# Altium project PAM_Interface_No_Bit_Shift.PrjPcb
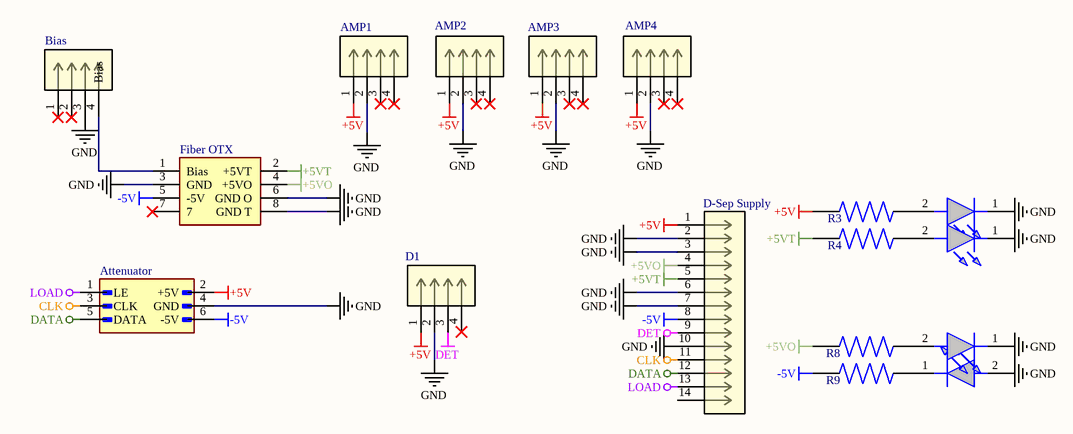
[diagram p0: PAM_Interface_No_Bit_Shift.SchDoc]
1 sheet, 17 parts. Net scope: global (net labels, ports and power ports of the same name join across sheets).
Board file: PAM_Interface_No_Bit_Shift.PcbDoc

## Sheet PAM_Interface_No_Bit_Shift.SchDoc
size A3; SheetNumber: 1; SheetTotal: 1

### Parts
+5VO  SML-LX1206GW-TR  [LEDC3216X110N]  (value not drawn)
+5VT  SML-LX1206GW-TR  [LEDC3216X110N]  (value not drawn)
-5V  SML-LX1206GW-TR  [LEDC3216X110N]  (value not drawn)
AMP1  DF11-4DP-2DSA(24)  [CON4_2X2_UF_DF11_HIR]  (value not drawn)
AMP2  DF11-4DP-2DSA(24)  [CON4_2X2_UF_DF11_HIR]  (value not drawn)
AMP3  DF11-4DP-2DSA(24)  [CON4_2X2_UF_DF11_HIR]  (value not drawn)
AMP4  DF11-4DP-2DSA(24)  [CON4_2X2_UF_DF11_HIR]  (value not drawn)
Attenuator  DF11-6DP-2DSA(24)  [HIROSE_DF11-6DP-2DSA(24)]  (value not drawn)
Bias  DF11-4DP-2DSA(24)  [CON4_2X2_UF_DF11_HIR]  (value not drawn)
D1  DF11-4DP-2DSA(24)  [CON4_2X2_UF_DF11_HIR]  (value not drawn)
D-Sep_Supply  DF11-14DP-2DSA(24)  [CON14_2X7_UF_DF11_HIR]  (value not drawn)
Fiber_OTX  DF11-8DP-2DSA(24)  [HIROSE_DF11-8DP-2DSA(24)]  (value not drawn)
LED1  SML-LX1206GW-TR  [LEDC3216X110N]  (value not drawn)
R3  ERA6VEB1000V  [RES_ERA6VEB1000V]  (value not drawn)
R4  ERA6VEB1000V  [RES_ERA6VEB1000V]  (value not drawn)
R8  ERA6VEB1000V  [RES_ERA6VEB1000V]  (value not drawn)
R9  ERA6VEB1000V  [RES_ERA6VEB1000V]  (value not drawn)

### Nets
+5V: AMP1.1(+5V) AMP2.1(+5V) AMP3.1(+5V) AMP4.1(+5V) Attenuator.2(+5V) D1.1(+5V) D-Sep_Supply.1(+5V) R3.1
+5VO: D-Sep_Supply.4(GND) Fiber_OTX.4(+5VO) R8.1
+5VT: D-Sep_Supply.5(DET) Fiber_OTX.2(+5VT) R4.2
-5V: Attenuator.6(-5V) D-Sep_Supply.8(NC) Fiber_OTX.5(-5V) R9.1
CLK: Attenuator.3(CLK) D-Sep_Supply.11(GND)
DATA: Attenuator.5(DATA) D-Sep_Supply.12(-5V)
DET: D1.3(DET) D-Sep_Supply.9(GND)
GND: +5VO.1(K) +5VT.1(K) -5V.2(A) AMP1.2(GND) AMP2.2(GND) AMP3.2(GND) AMP4.2(GND) Attenuator.4(GND) Bias.3(GND) D1.2(GND) D-Sep_Supply.2(GND) D-Sep_Supply.3(+5V_TEC) D-Sep_Supply.6(CLK) D-Sep_Supply.7(LOAD) D-Sep_Supply.10(+5V_OTX) Fiber_OTX.3(GND) Fiber_OTX.6(GND_O) Fiber_OTX.8(GND_T) LED1.1(K)
LOAD: Attenuator.1(LE) D-Sep_Supply.13(GND)
Net+5VO_2: +5VO.2(A) R8.2
Net+5VT_2: +5VT.2(A) R4.1
Net-5V_1: -5V.1(K) R9.2
NetBias_4: Bias.4(Bias) Fiber_OTX.1(Bias)
NetLED1_2: LED1.2(A) R3.2

Not connected (* = marked no-connect by the designer): AMP1 3* 4*; AMP2 3* 4*; AMP3 3* 4*; AMP4 3* 4*; Bias 1* 2*; D1 4*; D-Sep_Supply 14(DATA); Fiber_OTX 7*

### Library data of the parts
+5VO +5VT -5V LED1 = SML-LX1206GW-TR: LUMEX - SML-LX1206GW-TR - LED, 2MM X 1.6MM, GREEN, 10MCD, 565NM; Geometry.Height: 1.1mm; Manufacturer_Name: Lumex; Manufacturer_Part_Number: SML-LX1206GW-TR; Mouser Part Number: 696-SML-LX1206GW; Mouser Price/Stock: https://www.mouser.co.uk/ProductDetail/Lumex/SML-LX1206GW-TR?qs=k7wqd3tv8MigBobUZMRxZw%3D%3D; Arrow Part Number: SML-LX1206GW-TR; Arrow Price/Stock: https://www.arrow.com/en/products/sml-lx1206gw-tr/lumex?region=nac; Datasheet Link: https://datasheet.datasheetarchive.com/originals/distributors/Datasheets-315/519820.pdf
AMP1-AMP4 Bias D1 = DF11-4DP-2DSA24: No Description Available; Manufacturer_Name: Hirose; Copyright: Copyright (C) 2025 Ultra Librarian. All rights reserved.; Manufacturer_Part_Number: DF11-4DP-2DSA(24); RefDes: RefDes; Type: Type
Attenuator = DF11-6DP-2DSA(24): Connector Header Through Hole 6 position 0.079 (2.00mm); MF: Hirose Electric Co Ltd; SnapEDA_Link: https://www.snapeda.com/parts/DF11-6DP-2DSA(24)/Hirose+Electric+Co+Ltd/view-part/?ref=snap; Package: None; Value: *; MP: DF11-6DP-2DSA(24); Check_prices: https://www.snapeda.com/parts/DF11-6DP-2DSA(24)/Hirose+Electric+Co+Ltd/view-part/?ref=eda
D-Sep_Supply = DF11-14DP-2DSA24: No Description Available; Manufacturer_Name: Hirose; Copyright: Copyright (C) 2025 Ultra Librarian. All rights reserved.; Manufacturer_Part_Number: DF11-14DP-2DSA(24); RefDes: RefDes; Type: Type
Fiber_OTX = DF11-8DP-2DSA(24): Connector Header Through Hole 8 position 0.079 (2.00mm); MF: Hirose Electric; SnapEDA_Link: https://www.snapeda.com/parts/DF11-8DP-2DSA(24)/Hirose/view-part/?ref=snap; Package: None; Value: *; MP: DF11-8DP-2DSA(24); Check_prices: https://www.snapeda.com/parts/DF11-8DP-2DSA(24)/Hirose/view-part/?ref=eda
R3 R4 R8 R9 = ERA6VEB1000V: Package: None; Value: *; MP: ERA6VEB1000V; Availability: Unavailable; Price: None